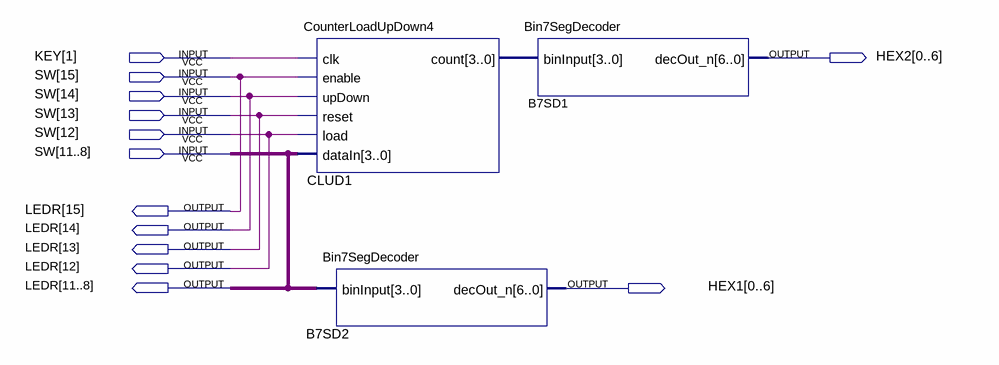
[diagram p0: schematic sheet]
// Quartus schematic Counter_Demo_LoadUpDown4.bdf as structural Verilog: 3 symbols, 13 pins
module Counter_Demo_LoadUpDown4 (
  input  [1:1] KEY,
  input  [15:8] SW,
  output [0:6] HEX2,
  output [15:8] LEDR,
  output [0:6] HEX1
);

  wire [3:0] CLUD1_count;

  CounterLoadUpDown4 CLUD1 (
    .clk(KEY[1]), .enable(SW[15]), .upDown(SW[14]), .reset(SW[13]), .load(SW[12]), .dataIn(SW[11:8]),
    .count(CLUD1_count));
  Bin7SegDecoder B7SD2 (.binInput(SW[11:8]), .decOut_n(HEX1));
  Bin7SegDecoder B7SD1 (.binInput(CLUD1_count), .decOut_n(HEX2));

  assign LEDR = SW;
endmodule
